# Altium schematic sheet MainBoard_MCU_Power.SchDoc
size B
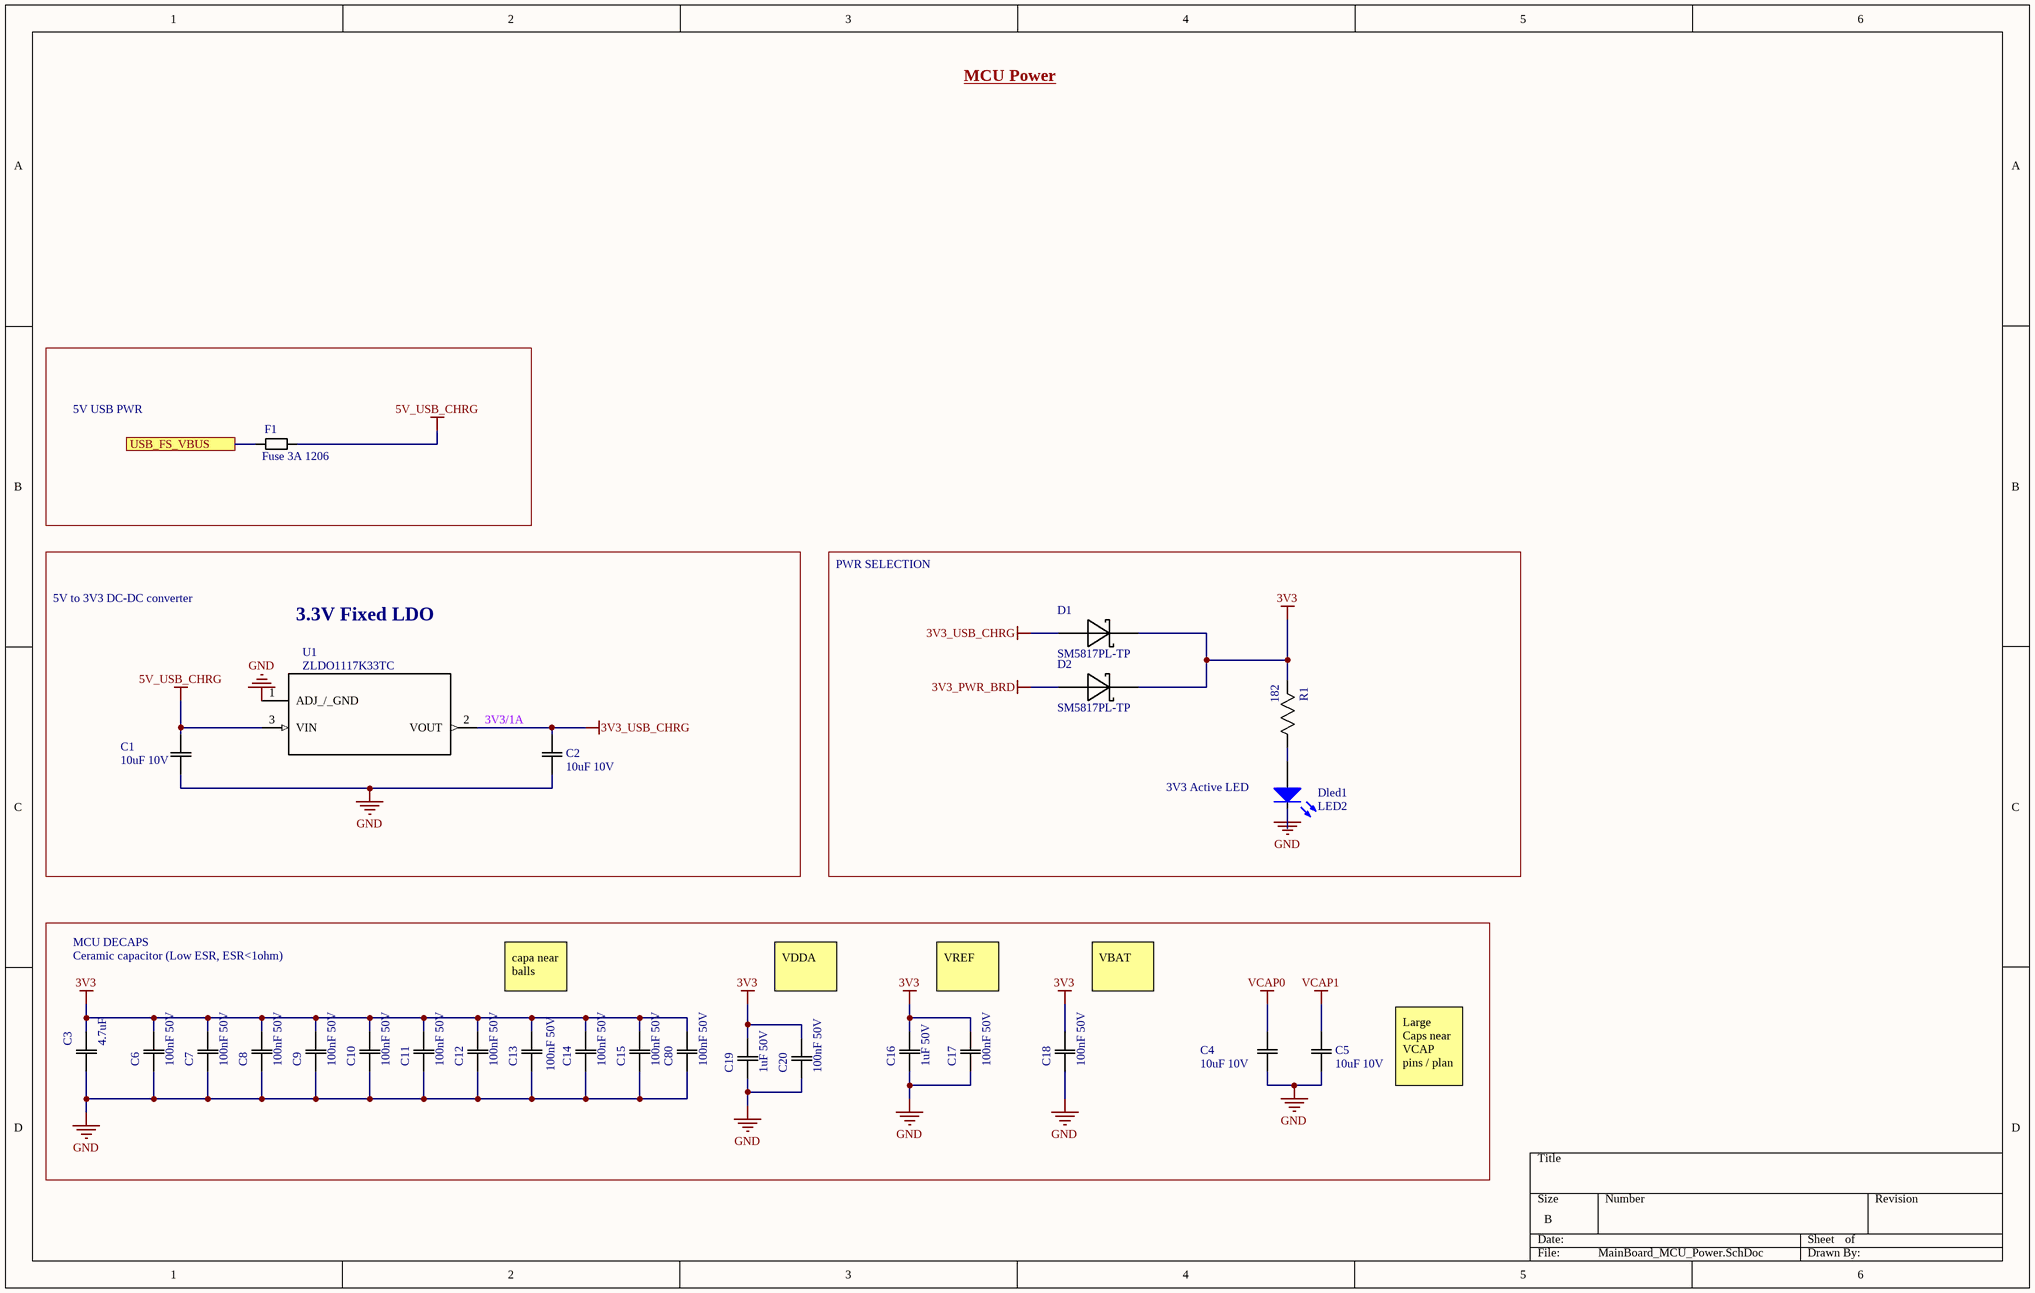
[diagram p0: MainBoard_MCU_Power.SchDoc]

## Parts
C1  10uF 10V  [0805]
C2  10uF 10V  [0805]
C3  4.7uF  [0805]
C4  10uF 10V  [0805]
C5  10uF 10V  [0805]
C6  100nF 50V  [0805]
C7  100nF 50V  [0805]
C8  100nF 50V  [0805]
C9  100nF 50V  [0805]
C10  100nF 50V  [0805]
C11  100nF 50V  [0805]
C12  100nF 50V  [0805]
C13  100nF 50V  [0805]
C14  100nF 50V  [0805]
C15  100nF 50V  [0805]
C16  1uF 50V  [0805]
C17  100nF 50V  [0805]
C18  100nF 50V  [0805]
C19  1uF 50V  [0805]
C20  100nF 50V  [0805]
C80  100nF 50V  [0805]
D1  SM5817PL-TP  [SOD-123]
D2  SM5817PL-TP  [SOD-123]
Dled1  LED2  [3.2X1.6X1.1]
F1  Fuse 3A 1206  [1206]
R1  182  [0805]
U1  ZLDO1117K33TC  [DPAK (TO-252)]

## Blocks framed on the sheet
5V USB PWR: F1
3.3V Fixed LDO: C1 C2 U1

## Ports
USB_FS_VBUS

## Nets
3V3: C3.2(C2) C6.2(C2) C7.2(C2) C8.2(C2) C9.2(C2) C10.2(C2) C11.2(C2) C12.2(C2) C13.2(C2) C14.2(C2) C15.2(C2) C16.2(C2) C17.2(C2) C18.2(C2) C19.2(C2) C20.2(C2) C80.2(C2) D1.C(K) D2.C(K) R1.2(R2)
3V3_PWR_BRD: D2.A
3V3_USB_CHRG: C2.1(C1) D1.A U1.2(VOUT)
5V_USB_CHRG: C1.1(C1) F1.2 U1.3(VIN)
GND: C1.2(C2) C2.2(C2) C3.1(C1) C4.2(C2) C5.2(C2) C6.1(C1) C7.1(C1) C8.1(C1) C9.1(C1) C10.1(C1) C11.1(C1) C12.1(C1) C13.1(C1) C14.1(C1) C15.1(C1) C16.1(C1) C17.1(C1) C18.1(C1) C19.1(C1) C20.1(C1) C80.1(C1) Dled1.2(K) U1.1(ADJ_/_GND)
VCAP0: C4.1(C1)
VCAP1: C5.1(C1)
USB_FS_VBUS: F1.1 ; port USB_FS_VBUS
NetDled1_1: Dled1.1(A) R1.1(R1)

## Notes on the sheet
- MCU Power
- PWR SELECTION
- 5V to 3V3 DC-DC converter
- 3V3/1A
- (near Dled1) 3V3 Active LED
- MCU DECAPS
- Ceramic capacitor (Low ESR, ESR<1ohm)
- capa near balls
- VDDA
- VREF
- VBAT
- Large Caps near VCAP pins / plan

## Library data of the parts
C1 C2 C4 C5 = CAP 10uF 10V: CAP CER 10UF 10V X5R 0805; Tolerance: 10%; Package: 0805; Value: 10uF; Rating: 10V
C3 = CAP 4.7uF 35V: CAP CER 4.7UF 35V X7R 0603/0805; Tolerance: 10%; Package: 0603/0805; Value: 4.7uF; Rating: 35V; Temperature Coefficient: X7R; Operating Temperature: -55°C ~ 125°C
C6-C15 C17 C18 C20 C80 = CAP 100nF 50V: CAP CER 0.1UF 50V X7R 0805; Tolerance: 10%; Package: 0805; Value: 100nF; Rating: 50V
C16 C19 = CAP 1uF 50V: CAP CER 1UF 50V X7R 0805; Tolerance: 10%; Package: 0805; Value: 1uF; Rating: 50V; Temperature Coefficient: X7R; Operating Temperature: -55°C ~ 125°C
D1 D2 = DIODE SCHOTTKY 20V 1A: Diode Schottky 20V 1A Surface Mount SOD-123FL; MF: Micro Commercial Co; ComponentLink1Description: digikey; ComponentLink1URL: https://www.digikey.ca/product-detail/en/on-semiconductor/MBR0540T1G/MBR0540T1GOSCT-ND/917967; Digikey: SM5817PL-TPMSCT-ND; Digikey Link: https://www.digikey.ca/product-detail/en/micro-commercial-co/SM5817PL-TP/SM5817PL-TPMSCT-ND/1793410; MP: SM5817PL-TP; Voltage Rating: 20V; Package: SOD-123; Current Rating: 1A
Dled1 = LED GREEN SMD: Typical RED, GREEN, YELLOW, AMBER GaAs LED; Voltage - Forward (Vf) (Typ): 2V; Lens Transparency: Clear; Current - Test: 20mA; Package: 1206; Color: Green
F1 = FUSE 3A 63V SLOW: FUSE 3A 63V AC/DC SLOW 1206; Response Time: Slow Blow; Current Rating (Amps): 3A; Operating Temperature: -55°C ~ 90°C; Voltage Rating - AC: 63V; Voltage Rating - DC: 63V
R1 = RES 182.0 1/8W: RES SMD 182 OHM 1% 1/8W 0805; Power (Watts): 0.125W; Package: 0805; Value: 182; Tolerance: 1%
U1 = ZLDO1117K33TC: Linear Voltage Regulator IC Positive Fixed 1 Output  1A TO-252-3; MF: Diodes Incorporated; Package: TO-252-3; MP: ZLDO1117K33TC; Digikey: ZLDO1117K33DIDKR-ND; Digikey Link: https://www.digikey.ca/product-detail/en/diodes-incorporated/ZLDO1117K33TC/ZLDO1117K33DIDKR-ND/2095639; Supplier 1: Digi-Key; Supplier Part Number 1: ZLDO1117K33DICT-ND